# EasyEDA schematic Flipper Zero Dual ESP32.json
TITLE: Dual ESP-32; REV: 1.0; Date: 2025-01-05; Sheet: 1/1; Drawn By: jv7273
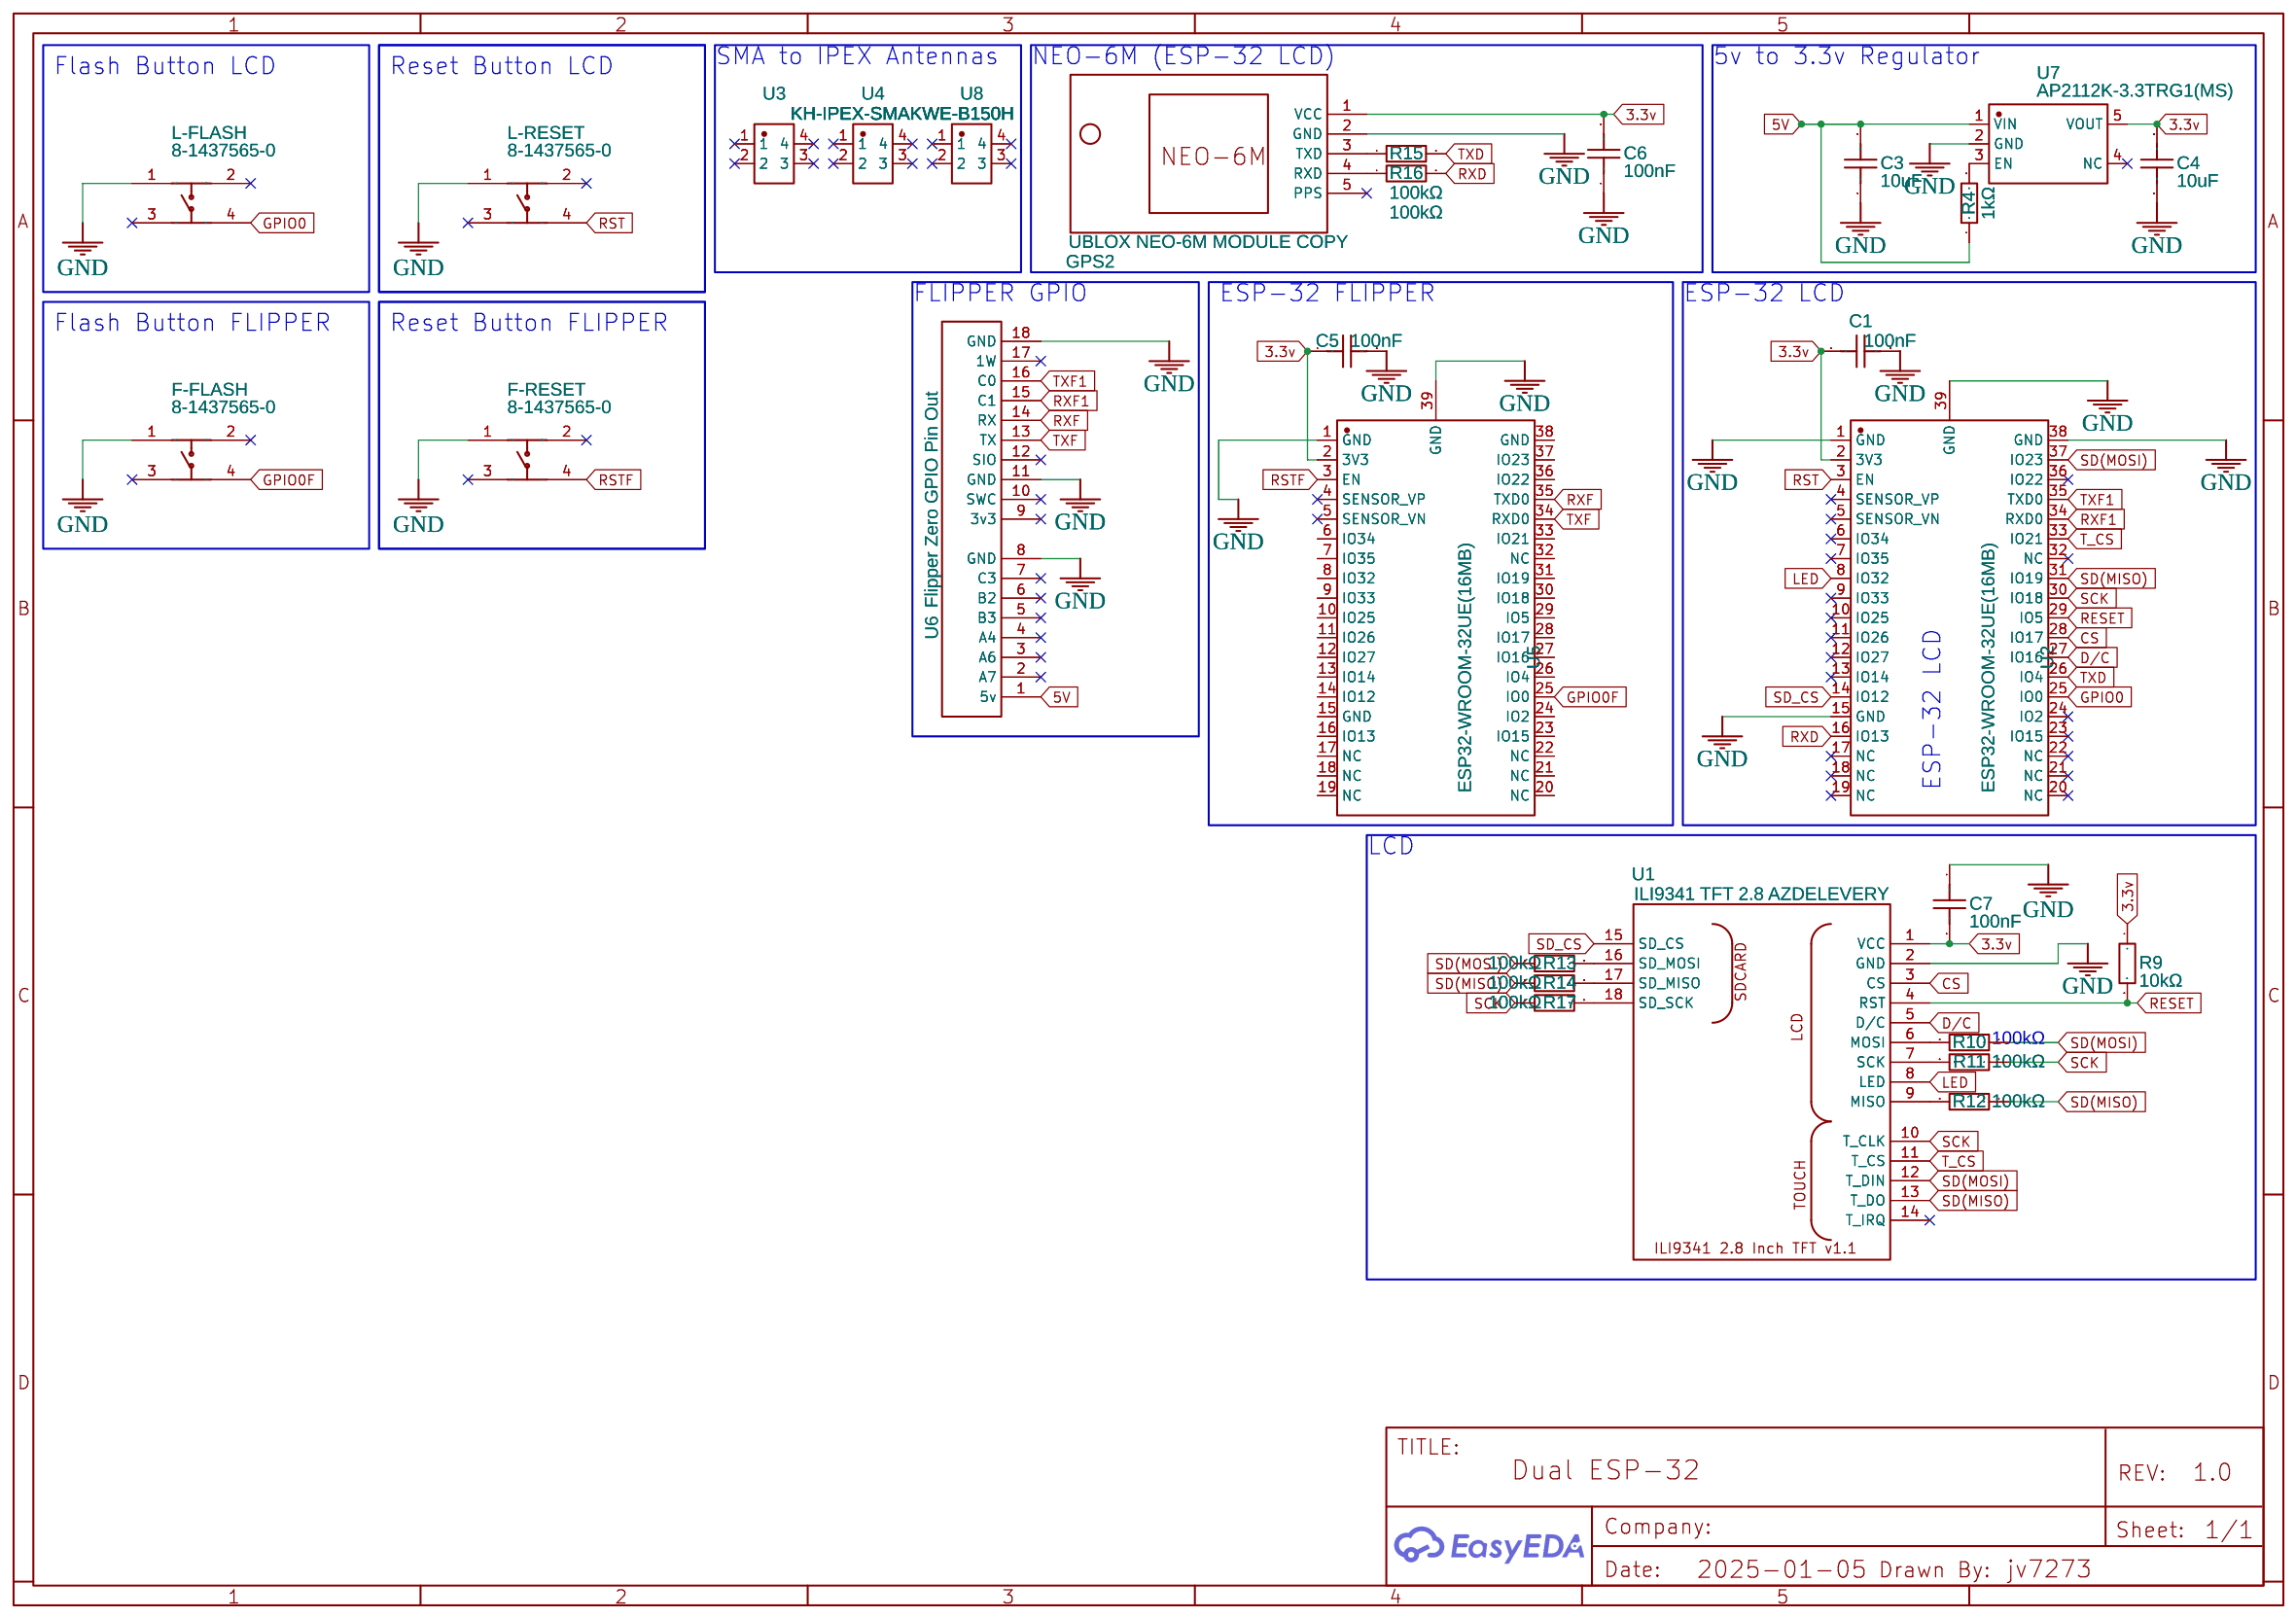
[diagram p0: schematic sheet]

## Parts
C1  100nF  [C0402]
C3  10uF  [C0603]
C4  10uF  [C0603]
C5  100nF  [C0402]
C6  100nF  [C0402]
C7  100nF  [C0402]
F-FLASH  8-1437565-0  [KEY-SMD_4P-L5.0-W4.9-P3.70-LS6.6]
F-RESET  8-1437565-0  [KEY-SMD_4P-L5.0-W4.9-P3.70-LS6.6]
GPS2  UBLOX NEO-6M MODULE COPY  [UBLOX_NEO-6M_GPS_MODULE]
L-FLASH  8-1437565-0  [KEY-SMD_4P-L5.0-W4.9-P3.70-LS6.6]
L-RESET  8-1437565-0  [KEY-SMD_4P-L5.0-W4.9-P3.70-LS6.6]
R4  1kΩ  [R1206]
R9  10kΩ  [R1206]
R10  100kΩ  [R0603]
R11  100kΩ  [R0603]
R12  100kΩ  [R0603]
R13  100kΩ  [R0603]
R14  100kΩ  [R0603]
R15  100kΩ  [R0603]
R16  100kΩ  [R0603]
R17  100kΩ  [R0603]
U1  ILI9341 TFT 2.8 AZDELEVERY  [ILI9341-2.8]
U2  ESP32-WROOM-32UE(16MB)  [WIFI-SMD_ESP32-WROOM-32UE]
U3  KH-IPEX-SMAKWE-B150H  [CONN-TH_KH-IPEX-SMAKWE]
U4  KH-IPEX-SMAKWE-B150H  [CONN-TH_KH-IPEX-SMAKWE]
U5  ESP32-WROOM-32UE(16MB)  [WIFI-SMD_ESP32-WROOM-32UE]
U6  Flipper Zero GPIO Pin Out  [FLIPPER ZERO]
U7  AP2112K-3.3TRG1(MS)  [SOT-23-5_L2.9-W1.6-P0.95-LS2.7-BR]
U8  KH-IPEX-SMAKWE-B150H  [CONN-TH_KH-IPEX-SMAKWE]

## Library data of the parts
C1 C5-C7 = CL05B104KO5NNNC: Supplier: LCSC; Manufacturer: SAMSUNG(三星); Supplier Part: C1525; JLCPCB Part Class: Basic Part
C3 C4 = CL10A106MQ8NNNC: Supplier: LCSC; Manufacturer: SAMSUNG(三星); Supplier Part: C1691; JLCPCB Part Class: Extended Part
F-FLASH F-RESET L-FLASH L-RESET = 8-1437565-0: Contributor: LCSC; Supplier: LCSC; Supplier Part: C266214; Manufacturer: TE Connectivity(泰科电子); JLCPCB Part Class: Extended Part
GPS2 = UBLOX NEO-6M MODULE COPY: Supplier: eBay; Contributor: shivaniagarwal
R4 = 1206W4J0102T5E: Supplier: LCSC; Manufacturer: UNI-ROYAL(厚声); Supplier Part: C1469; JLCPCB Part Class: Extended Part
R9 = 1206W4J0103T5E: Supplier: LCSC; Manufacturer: UNI-ROYAL(厚声); Supplier Part: C1489; JLCPCB Part Class: Extended Part
R10-R17 = RC0603FR-07100KL: Contributor: LCSC; Supplier: LCSC; Supplier Part: C14675; Manufacturer: YAGEO(国巨); JLCPCB Part Class: Extended Part
U1 = ILI9341 TFT 2.8 AZDELEVERY: Contributor: penotg
U2 U5 = ESP32-WROOM-32UE(16MB): Contributor: LCSC; Supplier: LCSC; Supplier Part: C701346; Manufacturer: ESPRESSIF(乐鑫); Manufacturer Part: ESP32-WROOM-32UE-N16; JLCPCB Part Class: Extended Part
U3 U4 U8 = KH-IPEX-SMAKWE-B150H: Supplier: LCSC; Supplier Part: C530652; Manufacturer: kinghelm(金航标); JLCPCB Part Class: Extended Part; Contributor: lcsc
U6 = Flipper Zero: Contributor: who.just.the.doctor
U7 = AP2112K-3.3TRG1(MS): Supplier: LCSC; Supplier Part: C22365427; Manufacturer: MSKSEMI(美森科); JLCPCB Part Class: Extended Part; Contributor: lcsc

## Nets
3.3v: C1.1 C4.2 C5.1 C6.2 C7.2 GPS2.1(VCC) R9.1 U1.1(VCC) U2.2(3V3) U5.2(3V3) U7.5(VOUT)
5V: C3.2 R4.1 U6.1(5v) U7.1(VIN)
GND: C1.2 C3.1 C4.1 C5.2 C6.1 C7.1 F-FLASH.1 F-RESET.1 GPS2.2(GND) L-FLASH.1 L-RESET.1 U1.2(GND) U2.1(GND) U2.15(GND) U2.38(GND) U2.39(GND) U5.1(GND) U5.39(GND) U6.8(GND) U6.11(GND) U6.18(GND) U7.2(GND)
CS: U1.3(CS) U2.28(IO17)
D/C: U1.5(D/C) U2.27(IO16)
GPIO0: L-FLASH.4 U2.25(IO0)
GPIO0F: F-FLASH.4 U5.25(IO0)
LED: U1.8(LED) U2.8(IO32)
RESET: R9.2 U1.4(RST) U2.29(IO5)
RST: L-RESET.4 U2.3(EN)
RSTF: F-RESET.4 U5.3(EN)
RXD: R16.2 U2.16(IO13)
RXF: U5.35(TXD0) U6.14(RX)
RXF1: U2.34(RXD0) U6.15(C1)
SCK: R11.1 R17.1 U1.10(T_CLK) U2.30(IO18)
SD(MISO): R12.1 R14.1 U1.13(T_DO) U2.31(IO19)
SD(MOSI): R10.1 R13.1 U1.12(T_DIN) U2.37(IO23)
SD_CS: U1.15(SD_CS) U2.14(IO12)
T_CS: U1.11(T_CS) U2.33(IO21)
TXD: R15.2 U2.26(IO4)
TXF: U5.34(RXD0) U6.13(TX)
TXF1: U2.35(TXD0) U6.16(C0)
Net-(GPS2-3): GPS2.3(TXD) R15.1
Net-(GPS2-4): GPS2.4(RXD) R16.1
Net-(R4-2): R4.2 U7.3(EN)
Net-(R10-2): R10.2 U1.6(MOSI)
Net-(R11-2): R11.2 U1.7(SCK)
Net-(R12-2): R12.2 U1.9(MISO)
Net-(R13-2): R13.2 U1.16(SD_MOSI)
Net-(R14-2): R14.2 U1.17(SD_MISO)
Net-(R17-2): R17.2 U1.18(SD_SCK)

Not connected (* = marked no-connect by the designer): F-FLASH 2* 3*; F-RESET 2* 3*; GPS2 5(PPS)*; L-FLASH 2* 3*; L-RESET 2* 3*; U1 14(T_IRQ)*; U2 4(SENSOR_VP)* 5(SENSOR_VN)* 6(IO34)* 7(IO35)* 9(IO33)* 10(IO25)* 11(IO26)* 12(IO27)* 13(IO14)* 17(NC)* 18(NC)* 19(NC)* 20(NC)* 21(NC)* 22(NC)* 23(IO15)* 24(IO2)* 32(NC)* 36(IO22)*; U3 1* 2* 3* 4*; U4 1* 2* 3* 4*; U5 4(SENSOR_VP)* 5(SENSOR_VN)* 6(IO34) 7(IO35) 8(IO32) 9(IO33) 10(IO25) 11(IO26) 12(IO27) 13(IO14) 14(IO12) 15(GND) 16(IO13) 17(NC) 18(NC) 19(NC) 20(NC) 21(NC) 22(NC) 23(IO15) 24(IO2) 26(IO4) 27(IO16) 28(IO17) 29(IO5) 30(IO18) 31(IO19) 32(NC) 33(IO21) 36(IO22) 37(IO23) 38(GND); U6 2(A7)* 3(A6)* 4(A4)* 5(B3)* 6(B2)* 7(C3)* 9(3v3)* 10(SWC)* 12(SIO)* 17(1W)*; U7 4(NC)*; U8 1* 2* 3* 4*

## Notes on the sheet
- SMA to IPEX Antennas
- NEO-6M (ESP-32 LCD)
- 5v to 3.3v Regulator
- Flash Button LCD
- Reset Button LCD
- FLIPPER GPIO
- ESP-32 FLIPPER
- ESP-32 LCD
- Flash Button FLIPPER
- Reset Button FLIPPER
- ESP-32 LCD
- LCD
- 100kΩ
